# Altium schematic sheet 5V Converter.SchDoc
size A4; SheetNumber: 4; SheetTotal: 4
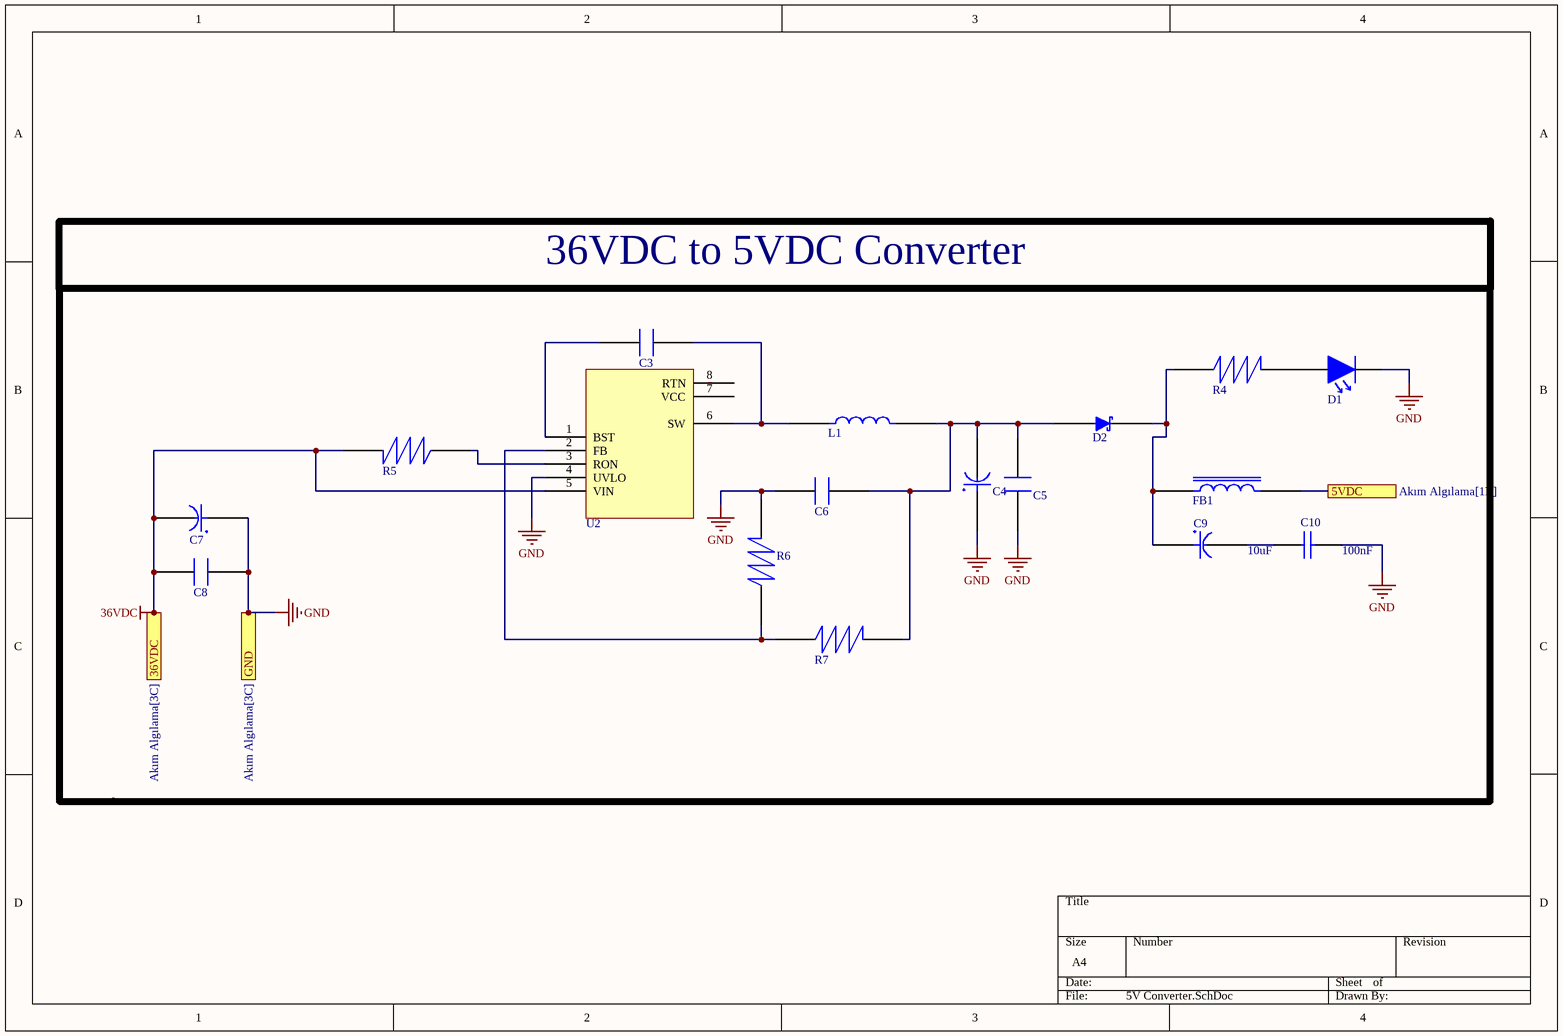
[diagram p0: 5V Converter.SchDoc]

## Parts
C3  C0603C103F3GECAUTO  [CAP_0603]  (value not drawn)
C4  EEV226M025S9DAA  [EEV Series]  (value not drawn)
C5  CL05B104KA5NNNC  [CAP_1005]  (value not drawn)
C6  CL05B104KA5NNNC  [CAP_1005]  (value not drawn)
C7  EEE-FK1H100UR  [CAP_RADIAL_EEE-FK1H100UR]  (value not drawn)
C8  KGM21NR71H104KT  [CAP_2012]  (value not drawn)
C9  value 10uF  [CAP_TANTAL_1411 [3528 Metric]]  (hidden comment: T494B106K016AT)
C10  Capacitance: 100nF  [CAP_0603]  (hidden comment: C0603C104K5RACTU)
D1  LTST-C171GKT  [LED_GREEN_0805]  (value not drawn)
D2  SS14  [SMA-2 (SS14)]  (value not drawn)
FB1  BLM21PG221SN1D  [CAP_0805]  (value not drawn)
L1  SRN8040-101M  [SRN8040-101M]  (value not drawn)
R4  CRG0603F330R  [RES_0603]  (value not drawn)
R5  ERJ-3EKF3303V  [RES_0603]  (value not drawn)
R6  RC0603FR-071K2L  [RES_0603]  (value not drawn)
R7  RC0603FR-106K8L  [RES_0603]  (value not drawn)
U2  LM5017MR/NOPB  [SOIC8]  (value not drawn)

## Blocks framed on the sheet
36VDC to 5VDC Converter: C3-C10 D1 D2 FB1 L1 R4-R7 U2

## Ports
5VDC (see Akım Algılama[1B]), 36VDC (see Akım Algılama[3C]), GND (see Akım Algılama[3C])

## Nets
36VDC: C7.2 C8.1 R5.2 U2.5(VIN) ; port 36VDC
GND: C4.1 C5.2 C6.2 C7.1 C8.2 C10.2 D1.1 R6.2 U2.4(UVLO) ; port GND
5VDC: FB1.2 ; port 5VDC
NetC3_1: C3.1 L1.1 U2.6(SW)
NetC3_2: C3.2 U2.1(BST)
NetC4_2: C4.2 C5.1 C6.1 D2.2 L1.2 R7.2
NetC9_1: C9.1 D2.1 FB1.1 R4.1
NetC9_2: C9.2 C10.1
NetD1_2: D1.2 R4.2
NetR5_1: R5.1 U2.3(RON)
NetR6_1: R6.1 R7.1 U2.2(FB)

Not connected (* = marked no-connect by the designer): U2 7(VCC) 8(RTN)

## Library data of the parts
C3 = C0603C103F3GECAUTO: CAP CER 10000PF 25V C0G/NP0 0603; Manufacturer: KEMET; Designed by: ismet Akalın; Dielectric Material: Ceramic; Supplier: Mouser; Supplier Part Number: 80-C0603C103F3GEAUTO; Manufacturer Part Number: C0603C103F3GECAUTO; RoHS: Yes; Category: Ceramic Capacitors; Stock: 27687; Pricing: 1=0,8, 10=0,507, 50=0,455, 100=0,354, 1000=0,315, 10000=0,314 (USD); Pins: 2; Terminal Finish: Nickel; JESD-609 Code: e3; Capacitor Type: Ceramic; Reach SVHC Compliant: Yes; RoHS Compliant: Yes; ComponentLink1URL: https://datasheet.ciiva.com:443/pdfs/VipMasterIC/IC/KEME/KEME-S-A0008958440/KEME-S-A0008958440-1.pdf?src-supplier=IHS+Markit; ComponentLink1Description: https://datasheet.ciiva.com:443/pdfs/VipMasterIC/IC/KEME/KEME-S-A0008958440/KEME-S-A0008958440-1.pdf?src-supplier=IHS+Markit; ComponentLink2URL: https://datasheet.octopart.com/C0603C103F3GECAUTO-KEMET-datasheet-149521794.pdf?src-supplier=Farnell; ComponentLink2Description: https://datasheet.octopart.com/C0603C103F3GECAUTO-KEMET-datasheet-149521794.pdf?src-supplier=Farnell
C4 = EEV226M025S9DAA: CAP ALUM 22UF 20% 25V SMD; Manufacturer: KEMET; Designed by: ismet Akalın; Capacitor Type: Aluminium; Supplier: Mouser; Supplier Part Number: 80-EEV226M025S9DAA; Manufacturer Part Number: EEV226M025S9DAA; RoHS: Yes; Category: Aluminum Electrolytic Capacitors; Stock: 25705; Pricing: 1=0,32, 10=0,146, 50=0,146, 100=0,103, 1000=0,094, 10000=0,074 (USD); Pins: 2; Reach SVHC Compliant: Yes; RoHS Compliant: Yes; ComponentLink1URL: https://datasheet.ciiva.com:443/pdfs/VipMasterIC/IC/KEME/KEME-S-A0008611149/KEME-S-A0008611149-1.pdf?src-supplier=IHS+Markit; ComponentLink1Description: https://datasheet.ciiva.com:443/pdfs/VipMasterIC/IC/KEME/KEME-S-A0008611149/KEME-S-A0008611149-1.pdf?src-supplier=IHS+Markit; ComponentLink2URL: https://api.kemet.com/component-edge/download/datasheet/EEV226M025S9DAA.pdf?src-supplier=Digikey; ComponentLink2Description: https://api.kemet.com/component-edge/download/datasheet/EEV226M025S9DAA.pdf?src-supplier=Digikey
C5 C6 = CL05B104KA5NNNC: CAP CER 0.1UF 25V X7R 0402; Manufacturer: Samsung; Designed by: ismet Akalın; Dielectric Material: Ceramic; Multilayer: Yes; Tolerance  (fill in as +-): 10%; Supplier: Mouser; Supplier Part Number: 187-CL05B104KA5NNNC; Manufacturer Part Number: CL05B104KA5NNNC; RoHS: Yes; Category: Ceramic Capacitors; Stock: 308112; Pricing: 1=0,1, 10=0,008, 50=0,008, 100=0,007, 1000=0,004, 10000=0,002 (USD); Mounting Technology: Surface Mount; Pins: 2; Package Shape: Rectangular; Case/Package: 0402; Terminal Finish: Nickel; Min Operating Temperature: -55°C; Max Operating Temperature: 125°C; JESD-609 Code: e3; Value: 0.1uF; Capacitor Type: Ceramic; Packaging: Tape and Reel; Tolerance (fill in as +-): 10%; Rated DC Voltage (URdc): 25V; Temperature Characteristics Code: X7R; Termination: Wraparound; Reach SVHC Compliant: Yes; RoHS Compliant: Yes; ComponentLink1URL: https://datasheet.ciiva.com:443/pdfs/VipMasterIC/IC/SEMS/SEMS-S-A0008525088/SEMS-S-A0008525148-1.pdf?src-supplier=IHS+Markit; ComponentLink1Description: https://datasheet.ciiva.com:443/pdfs/VipMasterIC/IC/SEMS/SEMS-S-A0008525088/SEMS-S-A0008525148-1.pdf?src-supplier=IHS+Markit; ComponentLink2URL: http://www.samsungsem.com/kr/support/product-search/mlcc/CL05B104KA5NNNC.jsp?src-supplier=Digikey; ComponentLink2Description: http://www.samsungsem.com/kr/support/product-search/mlcc/CL05B104KA5NNNC.jsp?src-supplier=Digikey; ComponentLink3URL: https://datasheet.octopart.com/CL05B104KA5NNNC-Samsung-Electro-Mechanics-datasheet-116890910.pdf?src-supplier=Future+Electronics; ComponentLink3Description: https://datasheet.octopart.com/CL05B104KA5NNNC-Samsung-Electro-Mechanics-datasheet-116890910.pdf?src-supplier=Future+Electronics
C7 = EEE-FK1H100UR: CAP ALUM 10UF 20% 50V SMD; Manufacturer: Panasonic; Designed by: ismet Akalın; Dielectric Material: Aluminium; Polarity: Polarized; Leakage Current: 5uA; Ripple Current: 63.75mA; Tan Delta: 0.1; Reference Standard: AEC-Q200; Supplier: Mouser; Supplier Part Number: 667-EEE-FK1H100UR; Manufacturer Part Number: EEE-FK1H100UR; RoHS: Yes; Category: Aluminum Electrolytic Capacitors; Stock: 33696; Pricing: 1=0,36, 10=0,197, 50=0,197, 100=0,166, 1000=0,105, 10000=0,092 (USD); Mounting Technology: Surface Mount; Pins: 2; Case/Package: 2121; Min Operating Temperature: -55°C; Max Operating Temperature: 105°C; Value: 10uF; Capacitor Type: Aluminium; Tolerance  (fill in as +-): 20%; Package Style: SMTMeter; Packaging: Tape and Reel; Tolerance (fill in as +-): 20%; Rated DC Voltage (URdc): 50V; Termination: Flat; Length: 6.5mm; Width: 5.3mm; Height: 5.8mm; Reach SVHC Compliant: Yes; RoHS Compliant: Yes; ComponentLink1URL: https://datasheet.ciiva.com:443/pdfs/VipMasterIC/IC/PANA/PANA-S-A0009782343/PANA-S-A0009782343-1.pdf?src-supplier=IHS+Markit; ComponentLink1Description: https://datasheet.ciiva.com:443/pdfs/VipMasterIC/IC/PANA/PANA-S-A0009782343/PANA-S-A0009782343-1.pdf?src-supplier=IHS+Markit; ComponentLink2URL: https://datasheet.ciiva.com/11777/0900766b80e4e8b0-11777247.pdf?src-supplier=Rs; ComponentLink2Description: https://datasheet.ciiva.com/11777/0900766b80e4e8b0-11777247.pdf?src-supplier=Rs; ComponentLink3URL: https://datasheet.ciiva.com/29313/443489-da-01-en-smd-elko-vfk-c-10-uf-50v-29313597.pdf?src-supplier=Conrad; ComponentLink3Description: https://datasheet.ciiva.com/29313/443489-da-01-en-smd-elko-vfk-c-10-uf-50v-29313597.pdf?src-supplier=Conrad; ComponentLink4URL: https://datasheet.ciiva.com/48524/fk-eng-tds-48524072.pdf?src-supplier=Distrelec; ComponentLink4Description: https://datasheet.ciiva.com/48524/fk-eng-tds-48524072.pdf?src-supplier=Distrelec; ComponentLink5URL: https://datasheet.ciiva.com/43463/58258-43463526.pdf?src-supplier=Farnell; ComponentLink5Description: https://datasheet.ciiva.com/43463/58258-43463526.pdf?src-supplier=Farnell; ComponentLink6URL: https://datasheet.ciiva.com/46385/58258-46385983.pdf?src-supplier=Element14; ComponentLink6Description: https://datasheet.ciiva.com/46385/58258-46385983.pdf?src-supplier=Element14; ComponentLink7URL: https://datasheet.ciiva.com/14594/70258115-14594166.pdf?src-supplier=Allied+Electronics; ComponentLink7Description: https://datasheet.ciiva.com/14594/70258115-14594166.pdf?src-supplier=Allied+Electronics; ComponentLink8URL: https://datasheet.ciiva.com/46385/1676921-46385982.pdf?src-supplier=Element14; ComponentLink8Description: https://datasheet.ciiva.com/46385/1676921-46385982.pdf?src-supplier=Element14
C8 = KGM21NR71H104KT: CAP CER 0.1UF 50V X7R 0805; Manufacturer: Kyocera AVX; Manufacturer Part Number: 08055C104KAT2A; Designed by: ismet Akalın; Dielectric Material: Ceramic; Multilayer: Yes; Tolerance  (fill in as +-): 10%; Supplier: Mouser; Supplier Part Number: 581-08055C104K; RoHS: Yes; Category: Ceramic Capacitors; Stock: 1054406; Pricing: 1=0,1, 10=0,053, 50=0,053, 100=0,032, 1000=0,029, 10000=0,024 (USD); Mounting Technology: Surface Mount; Pins: 2; Package Shape: Rectangular; Case/Package: 0805; Terminal Finish: Nickel; Min Operating Temperature: -55°C; Max Operating Temperature: 125°C; JESD-609 Code: e3; Value: 0.1UF; Capacitor Type: Ceramic; Package Style: SMTMeter; Packaging: Tape and Reel; Tolerance (fill in as +-): 10%; Rated DC Voltage (URdc): 50V; Temperature Characteristics Code: X7R; Termination: Wraparound; Length: 2.01mm; Width: 1.25mm; Height: 0.94mm; Reach SVHC Compliant: Yes; RoHS Compliant: Yes; ComponentLink1URL: https://datasheet.ciiva.com:443/pdfs/VipMasterIC/IC/AVXC/AVXC-S-A0009640452/AVXC-S-A0009640452-1.pdf?src-supplier=IHS+Markit; ComponentLink1Description: https://datasheet.ciiva.com:443/pdfs/VipMasterIC/IC/AVXC/AVXC-S-A0009640452/AVXC-S-A0009640452-1.pdf?src-supplier=IHS+Markit; ComponentLink2URL: https://datasheet.ciiva.com/11786/0900766b802d4698-11786116.pdf?src-supplier=Rs; ComponentLink2Description: https://datasheet.ciiva.com/11786/0900766b802d4698-11786116.pdf?src-supplier=Rs; ComponentLink3URL: https://datasheet.ciiva.com/16199/cx7r-16199014.pdf?src-supplier=Future+Electronics; ComponentLink3Description: https://datasheet.ciiva.com/16199/cx7r-16199014.pdf?src-supplier=Future+Electronics; ComponentLink4URL: https://datasheet.ciiva.com/150/cx7r-150259.pdf?src-supplier=Digikey; ComponentLink4Description: https://datasheet.ciiva.com/150/cx7r-150259.pdf?src-supplier=Digikey; ComponentLink5URL: https://datasheet.ciiva.com/7812/cx7r-7812079.pdf?src-supplier=Element14; ComponentLink5Description: https://datasheet.ciiva.com/7812/cx7r-7812079.pdf?src-supplier=Element14; ComponentLink6URL: https://datasheet.ciiva.com/2988/cx7r-2988014.pdf?src-supplier=Avnet; ComponentLink6Description: https://datasheet.ciiva.com/2988/cx7r-2988014.pdf?src-supplier=Avnet
C9 = T494B106K016AT: TANTAL CAP 10UF 10% 16V SMD 1411 [3528 Metric] Polarized; Manufacturer: KEMET; Dielectric Material: Tantalum; ESR (Equivalent Series Resistance): 800mR; Leakage Current: 1.6uA; Ripple Current: 130.4mA; Tan Delta: 0.06; Reference Standard: AEC-Q200; Designed by: ismet Akalın; Supplier: Farnell; Supplier Part Number: 1692399; Manufacturer Part Number: T494B106K016AT; RoHS: Yes; Category: Tantalum Capacitors; Stock: 3665; Pricing: 10=0,421, 50=0,384, 100=0,347, 500=0,346, 1000=0,345 (EUR); Mounting Technology: Surface Mount; Pins: 2; Package Shape: Rectangular; Case/Package: 1411; Terminal Finish: Nickel; Min Operating Temperature: -55°C; Max Operating Temperature: 125°C; JESD-609 Code: e3; Polarity: Polarized; Capacitor Type: Tantalum; Tolerance  (fill in as +-): 10%; Package Style: SMTMeter; Packaging: Tape and Reel; Tolerance (fill in as +-): 10%; Rated DC Voltage (URdc): 16V; Termination: J BEND; Length: 3.5mm; Width: 2.8mm; Height: 1.9mm; Reach SVHC Compliant: Yes; RoHS Compliant: Yes; ComponentLink1URL: https://datasheet.ciiva.com:443/pdfs/VipMasterIC/IC/KEME/KEME-S-A0009782346/KEME-S-A0009782346-1.pdf?src-supplier=IHS+Markit; ComponentLink1Description: https://datasheet.ciiva.com:443/pdfs/VipMasterIC/IC/KEME/KEME-S-A0009782346/KEME-S-A0009782346-1.pdf?src-supplier=IHS+Markit; ComponentLink2URL: https://datasheet.ciiva.com/27747/1574858-27747690.pdf?src-supplier=Jameco; ComponentLink2Description: https://datasheet.ciiva.com/27747/1574858-27747690.pdf?src-supplier=Jameco; ComponentLink3URL: https://datasheet.ciiva.com/7696/1684480-7696458.pdf?src-supplier=Element14; ComponentLink3Description: https://datasheet.ciiva.com/7696/1684480-7696458.pdf?src-supplier=Element14; ComponentLink4URL: https://datasheet.ciiva.com/258/kem-t2008-t494-258909.pdf?src-supplier=Digikey; ComponentLink4Description: https://datasheet.ciiva.com/258/kem-t2008-t494-258909.pdf?src-supplier=Digikey; ComponentLink5URL: https://datasheet.ciiva.com/258/kem-t2008-t494-258910.pdf?src-supplier=Digikey; ComponentLink5Description: https://datasheet.ciiva.com/258/kem-t2008-t494-258910.pdf?src-supplier=Digikey; ComponentLink6URL: https://datasheet.ciiva.com/258/kem-t2008-t494-258911.pdf?src-supplier=Digikey; ComponentLink6Description: https://datasheet.ciiva.com/258/kem-t2008-t494-258911.pdf?src-supplier=Digikey; ComponentLink7URL: https://datasheet.ciiva.com/14588/70095890-14588342.pdf?src-supplier=Allied+Electronics; ComponentLink7Description: https://datasheet.ciiva.com/14588/70095890-14588342.pdf?src-supplier=Allied+Electronics
C10 = CAP CER 100nF 0603: CAP CER 100nF %10 0603 SMD; Manufacturer: KEMET; Designed by: BERK; Dielectric Material: Ceramic; Voltage Rating (DC): 50V; Tolerance: 10%; Dielectric: X7R; Dissipation Factor: 2.5%; Supplier 1: Digi-Key; Manufacturer Part Number: C0603C104K5RACTU; RoHS: Yes; Category: Ceramic Capacitors; Stock 1: 1666186; Pricing 1: 1=0,12000, 10=0,08500, 50=0,04620, 100=0,03770, 500=0,02696, 1000=0,02118 (USD); Mount: Surface Mount; Case/Package: 0603; Number of Pins: 2; Case Code (Metric): 1608; Case Code (Imperial): 0603; Contact Plating: Tin,Matte; Min Operating Temperature: -55°C; Max Operating Temperature: 125°C; Packaging: Tape and Reel; Package Quantity: 1; Termination: SMD/SMT; Voltage: 50V; Voltage Rating: 50V; Series: SMD Comm X7R; Length: 0.063inch; Width: 0.031inch; Height: 0.8mm; Thickness: 0.034inch; Lead Pitch: 0.7mm; Depth: 0.8mm; Radiation Hardening: No; RoHS Compliant: Yes; REACH SVHC: No SVHC; ComponentLink1URL: https://datasheet.ciiva.com/7823/kem-c1002-x7r-smd-7823591.pdf?src-supplier=Element14; ComponentLink1Description: https://datasheet.ciiva.com/7823/kem-c1002-x7r-smd-7823591.pdf?src-supplier=Element14; ComponentLink2URL: https://datasheet.ciiva.com/14602/70095383-14602583.pdf?src-supplier=Allied+Electronics; ComponentLink2Description: https://datasheet.ciiva.com/14602/70095383-14602583.pdf?src-supplier=Allied+Electronics; ComponentLink3URL: https://datasheet.ciiva.com/5999/kem-c1002-x7r-smd-5999400.pdf?src-supplier=Farnell; ComponentLink3Description: https://datasheet.ciiva.com/5999/kem-c1002-x7r-smd-5999400.pdf?src-supplier=Farnell; ComponentLink4URL: https://datasheet.ciiva.com/7823/kem-c1002-x7r-smd-7823592.pdf?src-supplier=Element14; ComponentLink4Description: https://datasheet.ciiva.com/7823/kem-c1002-x7r-smd-7823592.pdf?src-supplier=Element14; ComponentLink5URL: https://datasheet.ciiva.com/28645/1851736-28645640.pdf?src-supplier=Element14; ComponentLink5Description: https://datasheet.ciiva.com/28645/1851736-28645640.pdf?src-supplier=Element14; ComponentLink6URL: https://datasheet.ciiva.com/14585/70095383-14585209.pdf?src-supplier=Allied+Electronics; ComponentLink6Description: https://datasheet.ciiva.com/14585/70095383-14585209.pdf?src-supplier=Allied+Electronics; Supplier Part Number 1: 399-5089-1-ND
D1 = LED GREEN 0805: Green 0805 130 º Min 5 mcd Typical 12 mcd Water Clear Lens SMT LED; Manufacturer: Vishay Lite-On; Designed by: BERK; Lens Color: Colorless; Viewing Angle: 130°; Lens Style: Diffused,Colorless,Rectangular,Clear; Luminous Intensity: 12mcd; Forward Current: 30mA; Forward Voltage: 2.1V; Power Rating: 100mW; Dominant Wavelength: 569nm; Test Current: 10mA; Number of Elements: 1; Wavelength: 585nm; Reverse Voltage: 5V; Supplier 1: Digi-Key; Manufacturer Part Number: LTST-C171GKT; RoHS: Yes; Category: LEDs; Stock 1: 159023; Pricing 1: 1=0,26000, 10=0,14100, 100=0,06560, 500=0,06060, 1000=0,04747 (USD); Mount: Surface Mount; Case/Package: 0805; Number of Pins: 2; Color: Green; Case Code (Metric): 2012; Case Code (Imperial): 0805; Min Operating Temperature: -55°C; Max Operating Temperature: 85°C; Package Quantity: 1; Packaging: Tape and Reel; Illumination Color: Green; Lens Transparency: Clear; Power Dissipation: 100mW; Number of LEDs: 1; Series: CHIPLED 0805; Length: 2mm; Width: 1.25mm; Height: 0.8mm; Depth: 1.25mm; Radiation Hardening: No; Lead Free: Lead Free; RoHS Compliant: Yes; ComponentLink1URL: https://datasheet.ciiva.com/2110/ltst-c171gkt-2110000.pdf?src-supplier=Digi-Key; ComponentLink1Description: https://datasheet.ciiva.com/2110/ltst-c171gkt-2110000.pdf?src-supplier=Digi-Key; ComponentLink2URL: https://datasheet.ciiva.com/11773/0900766b80dc0296-11773991.pdf?src-supplier=RSComponents; ComponentLink2Description: https://datasheet.ciiva.com/11773/0900766b80dc0296-11773991.pdf?src-supplier=RSComponents; ComponentLink3URL: https://datasheet.ciiva.com/12400/lite-on-ltst-c171gkt-190133-12400647.pdf?src-supplier=Mouser; ComponentLink3Description: https://datasheet.ciiva.com/12400/lite-on-ltst-c171gkt-190133-12400647.pdf?src-supplier=Mouser; ComponentLink4URL: https://datasheet.ciiva.com/2110/ltst-c171gkt-2110001.pdf?src-supplier=Digi-Key; ComponentLink4Description: https://datasheet.ciiva.com/2110/ltst-c171gkt-2110001.pdf?src-supplier=Digi-Key; ComponentLink5URL: https://datasheet.ciiva.com/2110/ltst-c171gkt-2110002.pdf?src-supplier=Digi-Key; ComponentLink5Description: https://datasheet.ciiva.com/2110/ltst-c171gkt-2110002.pdf?src-supplier=Digi-Key; ComponentLink6URL: https://datasheet.ciiva.com/16396/ltst-c171gkt-16396549.pdf?src-supplier=Future+Electronics; ComponentLink6Description: https://datasheet.ciiva.com/16396/ltst-c171gkt-16396549.pdf?src-supplier=Future+Electronics; Supplier Part Number 1: 160-1423-1-ND
D2 = SS14: DIODE SCHOTTKY 40V 1A DO214AC; Manufacturer: ON Semiconductor / Fairchild; Designed by: ismet Akalın; Package Body Material: Plastic; Diode Element Material: SILICON; Diode Type: RECTIFIER; Number of Elements: 1; Forward Voltage: 500mV; Max Power Dissipation: 1.1W; Additional Feature: FREE WHEELING DIODE; Non-rep Pk Forward Current-Max: 30A; Qualification Status: Not Qualified; JEDEC-95 Code: DO-214AC; Supplier: Mouser; Supplier Part Number: 512-SS14; Manufacturer Part Number: SS14; RoHS: Yes; Category: Schottky Diodes; Stock: 78089; Pricing: 1=0,29, 10=0,195, 50=0,195, 100=0,117, 1000=0,088, 10000=0,063 (USD); Pins: 2; Package Shape: Rectangular; Terminal Finish: Tin; Min Operating Temperature: -65°C; Max Operating Temperature: 125°C; JESD-30 Code: R-PDSO-C2; Surface Mount: Yes; Technology: SCHOTTKY; Terminal Form: C BEND; Terminal Position: DUAL; Max Output current: 1A; Package Style: SMALL OUTLINEMeter; Rep Pk Reverse Voltage-Max: 40V; Moisture Sensitivity Level: 1; JESD-609 Code: e3; RoHS Compliant: Yes; Reach SVHC Compliant: No; ComponentLink1URL: https://datasheet.ciiva.com:443/pdfs/VipMasterIC/IC/ONSM/ONSM-S-A0007316185/ONSM-S-A0007316185-1.pdf?src-supplier=IHS+Markit; ComponentLink1Description: https://datasheet.ciiva.com:443/pdfs/VipMasterIC/IC/ONSM/ONSM-S-A0007316185/ONSM-S-A0007316185-1.pdf?src-supplier=IHS+Markit; ComponentLink2URL: http://www.onlinecomponents.com/datasheet/ss14.aspx?p=11369800&src-supplier=Onlinecomponents.com; ComponentLink2Description: http://www.onlinecomponents.com/datasheet/ss14.aspx?p=11369800&src-supplier=Onlinecomponents.com; ComponentLink3URL: http://www.produktinfo.conrad.com/datenblaetter/1200000-1299999/001265127-da-01-en-DIODE_SCHOTTKY_40V_1A_SS14_DO_214_AC_FSC.pdf?src-supplier=Conrad; ComponentLink3Description: http://www.produktinfo.conrad.com/datenblaetter/1200000-1299999/001265127-da-01-en-DIODE_SCHOTTKY_40V_1A_SS14_DO_214_AC_FSC.pdf?src-supplier=Conrad; ComponentLink4URL: https://www.verical.com/server-webapp/html/getDatasheet?partID=84776&src-supplier=Verical; ComponentLink4Description: https://www.verical.com/server-webapp/html/getDatasheet?partID=84776&src-supplier=Verical; ComponentLink5URL: https://datasheet.octopart.com/SS14.-Fairchild-Semiconductor-datasheet-3545.pdf?src-supplier=Element14; ComponentLink5Description: https://datasheet.octopart.com/SS14.-Fairchild-Semiconductor-datasheet-3545.pdf?src-supplier=Element14
FB1 = BLM21PG221SN1D: FERRITE BEAD 220 OHM 0805 1LN; Manufacturer: Murata; Channels: 1; DC Resistance-Max: 50mR; Filter Type: FERRITE CHIP; Clock Frequency: 100MHz; Output Impedance: 220R; Current Rating: 2A; Designed by: ismet Akalın; Supplier: Farnell; Supplier Part Number: 1515661; Manufacturer Part Number: BLM21PG221SN1D; RoHS: Yes; Category: Ferrite Beads and Chips; Stock: 72841; Pricing: 10=0,0682, 100=0,0519, 500=0,0417, 1000=0,0367, 2000=0,0313, 4000=0,0258 (EUR); Mounting Technology: Surface Mount; Terminal Finish: Nickel; Material: Ferrite; Case Code: 0805; Min Operating Temperature: -55°C; Max Operating Temperature: 125°C; JESD-609 Code: e3; Construction: Chip Bead; Min Frequency: 100MHz; Packaging: Tape and Reel; Length: 2mm; Width: 1.25mm; Height: 0.85mm; Reach SVHC Compliant: Yes; RoHS Compliant: Yes; ComponentLink1URL: https://datasheet.ciiva.com:443/pdfs/VipMasterIC/IC/MURE/MURE-S-A0008513560/MURE-S-A0008513560-1.pdf?src-supplier=IHS+Markit; ComponentLink1Description: https://datasheet.ciiva.com:443/pdfs/VipMasterIC/IC/MURE/MURE-S-A0008513560/MURE-S-A0008513560-1.pdf?src-supplier=IHS+Markit; ComponentLink2URL: https://datasheet.ciiva.com/30514/1845321-30514028.pdf?src-supplier=Jameco; ComponentLink2Description: https://datasheet.ciiva.com/30514/1845321-30514028.pdf?src-supplier=Jameco; ComponentLink3URL: https://datasheet.ciiva.com/1012/l0110s0100blm21p-1012288.pdf?src-supplier=Digikey; ComponentLink3Description: https://datasheet.ciiva.com/1012/l0110s0100blm21p-1012288.pdf?src-supplier=Digikey; ComponentLink4URL: https://datasheet.ciiva.com/11799/0900766b81275e31-11799232.pdf?src-supplier=Rs; ComponentLink4Description: https://datasheet.ciiva.com/11799/0900766b81275e31-11799232.pdf?src-supplier=Rs; ComponentLink5URL: https://datasheet.ciiva.com/29348/442529-da-01-en-chip-drossel-0805-220r-2000ma-2-0x1-25mm-29348007.pdf?src-supplier=Conrad; ComponentLink5Description: https://datasheet.ciiva.com/29348/442529-da-01-en-chip-drossel-0805-220r-2000ma-2-0x1-25mm-29348007.pdf?src-supplier=Conrad; ComponentLink6URL: https://datasheet.ciiva.com/1012/l0110s0100blm21p-1012287.pdf?src-supplier=Digikey; ComponentLink6Description: https://datasheet.ciiva.com/1012/l0110s0100blm21p-1012287.pdf?src-supplier=Digikey; ComponentLink7URL: https://datasheet.ciiva.com/1012/l0110s0100blm21p-1012289.pdf?src-supplier=Digikey; ComponentLink7Description: https://datasheet.ciiva.com/1012/l0110s0100blm21p-1012289.pdf?src-supplier=Digikey; ComponentLink8URL: https://datasheet.ciiva.com/3081/l0110s0100blm21p-3081655.pdf?src-supplier=Avnet; ComponentLink8Description: https://datasheet.ciiva.com/3081/l0110s0100blm21p-3081655.pdf?src-supplier=Avnet; ComponentLink9URL: https://datasheet.ciiva.com/16215/l0110s0100blm21p-16215194.pdf?src-supplier=Future+Electronics; ComponentLink9Description: https://datasheet.ciiva.com/16215/l0110s0100blm21p-16215194.pdf?src-supplier=Future+Electronics; ComponentLink10URL: https://datasheet.ciiva.com/8021/1756152-8021596.pdf?src-supplier=Element14; ComponentLink10Description: https://datasheet.ciiva.com/8021/1756152-8021596.pdf?src-supplier=Element14; ComponentLink11URL: https://datasheet.ciiva.com/8021/1756152-8021598.pdf?src-supplier=Element14; ComponentLink11Description: https://datasheet.ciiva.com/8021/1756152-8021598.pdf?src-supplier=Element14; ComponentLink12URL: https://datasheet.ciiva.com/14122/anblm21p-data-e-14122214.pdf?src-supplier=Distrelec; ComponentLink12Description: https://datasheet.ciiva.com/14122/anblm21p-data-e-14122214.pdf?src-supplier=Distrelec
L1 = SRN8040-101M: FIXED IND 100UH 1A 400 MOHM SMD; Manufacturer: Bourns; Core Material: Ferrite; Tolerance: 20%; Case/Size Code: 3232; DC Resistance (DCR): 400mR; Inductor Application: POWER INDUCTOR; Inductor Type: GENERAL PURPOSE INDUCTOR; Channels: 1; Shape/Size Description: RECTANGULAR PACKAGE; Shielding: Shielded; Test Frequency: 100kHz; Package Height: 4mm; Package Length: 8mm; Designed by: ismet Akalın; Supplier: Mouser; Supplier Part Number: 652-SRN8040-101M; Manufacturer Part Number: SRN8040-101M; RoHS: Yes; Category: Fixed Inductors; Stock: 21385; Pricing: 1=0,7, 10=0,513, 50=0,513, 100=0,439, 1000=0,272, 10000=0,253 (USD); Pins: 2; Terminal Finish: Copper; Min Operating Temperature: -40°C; Max Operating Temperature: 105°C; JESD-609 Code: e1; Construction: Shielded; Inductance-Nom (L): 100uH; Package Style: SMTMeter; Packaging: Tape and Reel; Max Current Rating: 1A; Surface Mount: Yes; Terminal Placement: Dual Ended; Termination: One Surface; Package Width: 8mm; Reach SVHC Compliant: Yes; RoHS Compliant: Yes; ComponentLink1URL: https://datasheet.ciiva.com:443/pdfs/VipMasterIC/IC/BOUR/BOUR-S-A0007011240/BOUR-S-A0007011240-1.pdf?src-supplier=IHS+Markit; ComponentLink1Description: https://datasheet.ciiva.com:443/pdfs/VipMasterIC/IC/BOUR/BOUR-S-A0007011240/BOUR-S-A0007011240-1.pdf?src-supplier=IHS+Markit; ComponentLink2URL: https://datasheet.ciiva.com/6689/srn8040-6689481.pdf?src-supplier=Digikey; ComponentLink2Description: https://datasheet.ciiva.com/6689/srn8040-6689481.pdf?src-supplier=Digikey; ComponentLink3URL: https://datasheet.ciiva.com/1049/srn8040-1049477.pdf?src-supplier=Digikey; ComponentLink3Description: https://datasheet.ciiva.com/1049/srn8040-1049477.pdf?src-supplier=Digikey; ComponentLink4URL: https://datasheet.ciiva.com/1049/srn8040-1049478.pdf?src-supplier=Digikey; ComponentLink4Description: https://datasheet.ciiva.com/1049/srn8040-1049478.pdf?src-supplier=Digikey; ComponentLink5URL: https://datasheet.ciiva.com/8515/srn8040-8515246.pdf?src-supplier=Avnet; ComponentLink5Description: https://datasheet.ciiva.com/8515/srn8040-8515246.pdf?src-supplier=Avnet
R4 = CRG0603F330R: RES SMD 330 OHM 1% 1/10W 0603; Manufacturer: TE Connectivity; Manufacturer Series: CRG; Designed by: ismet Akalın; Additional Feature: LASER TRIMMABLE; Power: 100mW; Rated Temperature: 70°C; Value: 330R; Working Voltage: 50V; Temperature Coefficient (ppm/Cel): 100; Supplier: Mouser; Supplier Part Number: 279-CRG0603F330R; Manufacturer Part Number: CRG0603F330R; RoHS: Yes; Category: Chip SMD Resistors; Stock: 26411; Pricing: 1=0,1, 10=0,023, 50=0,023, 100=0,012, 1000=0,006, 10000=0,004 (USD); Mounting Technology: Surface Mount; Pins: 2; Package Shape: Rectangular; Case/Package: 0603; Terminal Finish: Tin; Min Operating Temperature: -55°C; Max Operating Temperature: 125°C; Tolerance: 1%; JESD-609 Code: e3; Resistor Type: FIXED RESISTOR; Packaging: Tape and Reel; Technology: METAL GLAZE/THICK FILM; Termination: Wraparound; RoHS Compliant: Yes; ComponentLink1URL: https://datasheet.ciiva.com:443/pdfs/VipMasterIC/IC/TYEC/TYECS00469/TYECS00469-1.pdf?src-supplier=IHS+Markit; ComponentLink1Description: https://datasheet.ciiva.com:443/pdfs/VipMasterIC/IC/TYEC/TYECS00469/TYECS00469-1.pdf?src-supplier=IHS+Markit; ComponentLink2URL: https://datasheet.ciiva.com/11812/0900766b800a696e-11812377.pdf?src-supplier=Rs; ComponentLink2Description: https://datasheet.ciiva.com/11812/0900766b800a696e-11812377.pdf?src-supplier=Rs; ComponentLink3URL: https://datasheet.ciiva.com/2529/eng-cd-1622918-ba-2529817.pdf?src-supplier=Digikey; ComponentLink3Description: https://datasheet.ciiva.com/2529/eng-cd-1622918-ba-2529817.pdf?src-supplier=Digikey; ComponentLink4URL: https://datasheet.ciiva.com/8904/eng-ds-1773204-f-8904639.pdf?src-supplier=Avnet; ComponentLink4Description: https://datasheet.ciiva.com/8904/eng-ds-1773204-f-8904639.pdf?src-supplier=Avnet
R5 = ERJ-3EKF3303V: RES SMD 330K OHM 1% 1/10W 0603; Manufacturer: Panasonic; Designed by: ismet Akalın; Power: 100mW; Rated Temperature: 70°C; Value: 330kR; Working Voltage: 75V; Temperature Coefficient (ppm/Cel): 100; Package Height: 0.45mm; Package Length: 1.6mm; Package Width: 0.8mm; Reference Standard: AEC-Q200; Supplier: Mouser; Supplier Part Number: 667-ERJ-3EKF3303V; Manufacturer Part Number: ERJ-3EKF3303V; RoHS: Yes; Category: Chip SMD Resistors; Stock: 27005; Pricing: 1=0,1, 10=0,028, 50=0,028, 100=0,016, 1000=0,009, 10000=0,005 (USD); Mounting Technology: Surface Mount; Pins: 2; Package Shape: Rectangular; Case/Package: 0603; Terminal Finish: Nickel; Min Operating Temperature: -55°C; Max Operating Temperature: 155°C; Tolerance: 1%; JESD-609 Code: e3; Resistor Type: FIXED RESISTOR; Construction: Rectangular; Packaging: Tape and Reel; Technology: METAL GLAZE/THICK FILM; Termination: Wraparound; Reach SVHC Compliant: Yes; RoHS Compliant: Yes; ComponentLink1URL: https://datasheet.ciiva.com:443/pdfs/VipMasterIC/IC/PANA/PANA-S-A0009889626/PANA-S-A0009889626-1.pdf?src-supplier=IHS+Markit; ComponentLink1Description: https://datasheet.ciiva.com:443/pdfs/VipMasterIC/IC/PANA/PANA-S-A0009889626/PANA-S-A0009889626-1.pdf?src-supplier=IHS+Markit; ComponentLink2URL: https://datasheet.ciiva.com/7836/aoa0000ce2-7836502.pdf?src-supplier=Element14; ComponentLink2Description: https://datasheet.ciiva.com/7836/aoa0000ce2-7836502.pdf?src-supplier=Element14; ComponentLink3URL: https://datasheet.ciiva.com/22673/1678782-22673287.pdf?src-supplier=Element14; ComponentLink3Description: https://datasheet.ciiva.com/22673/1678782-22673287.pdf?src-supplier=Element14; ComponentLink4URL: https://datasheet.ciiva.com/22687/1678782-22687435.pdf?src-supplier=Element14; ComponentLink4Description: https://datasheet.ciiva.com/22687/1678782-22687435.pdf?src-supplier=Element14; ComponentLink5URL: https://datasheet.ciiva.com/24164/aoa0000ce2-24164038.pdf?src-supplier=Mouser; ComponentLink5Description: https://datasheet.ciiva.com/24164/aoa0000ce2-24164038.pdf?src-supplier=Mouser; ComponentLink6URL: https://datasheet.ciiva.com/16766/70260748-16766613.pdf?src-supplier=Allied+Electronics; ComponentLink6Description: https://datasheet.ciiva.com/16766/70260748-16766613.pdf?src-supplier=Allied+Electronics; ComponentLink7URL: https://datasheet.ciiva.com/16781/70260748-16781705.pdf?src-supplier=Allied+Electronics; ComponentLink7Description: https://datasheet.ciiva.com/16781/70260748-16781705.pdf?src-supplier=Allied+Electronics; ComponentLink8URL: https://datasheet.ciiva.com/9182/aoa0000ce2-9182954.pdf?src-supplier=Avnet; ComponentLink8Description: https://datasheet.ciiva.com/9182/aoa0000ce2-9182954.pdf?src-supplier=Avnet; ComponentLink9URL: https://datasheet.ciiva.com/9117/aoa0000ce2-9117145.pdf?src-supplier=Avnet; ComponentLink9Description: https://datasheet.ciiva.com/9117/aoa0000ce2-9117145.pdf?src-supplier=Avnet; ComponentLink10URL: https://datasheet.ciiva.com/30247/aoa0000ce2-30247322.pdf?src-supplier=Onlinecomponents.com; ComponentLink10Description: https://datasheet.ciiva.com/30247/aoa0000ce2-30247322.pdf?src-supplier=Onlinecomponents.com
R6 = RC0603FR-071K2L: RES 1.2K OHM 1% 1/10W 0603; Manufacturer: Yageo; Designed by: ismet Akalın; Additional Feature: LASER TRIMMABLE; Power: 100mW; Rated Temperature: 70°C; Value: 1.2kR; Working Voltage: 75V; Temperature Coefficient (ppm/Cel): 100; Package Height: 0.45mm; Package Length: 1.6mm; Package Width: 0.8mm; Supplier: Mouser; Supplier Part Number: 603-RC0603FR-071K2L; Manufacturer Part Number: RC0603FR-071K2L; RoHS: Yes; Category: Chip SMD Resistors; Stock: 2788; Pricing: 1=0,1, 10=0,009, 50=0,009, 100=0,008, 1000=0,006, 10000=0,003 (USD); Mounting Technology: Surface Mount; Pins: 2; Package Shape: Rectangular; Case/Package: 0603; Terminal Finish: Nickel; Min Operating Temperature: -55°C; Max Operating Temperature: 155°C; Tolerance: 1%; JESD-609 Code: e3; Resistor Type: FIXED RESISTOR; Construction: Chip; Packaging: Tape and Reel; Technology: METAL GLAZE/THICK FILM; Termination: Wraparound; Reach SVHC Compliant: Yes; RoHS Compliant: Yes; ComponentLink1URL: https://datasheet.ciiva.com:443/pdfs/VipMasterIC/IC/YAGO/YAGO-S-A0008145938/YAGO-S-A0008145938-1.pdf?src-supplier=IHS+Markit; ComponentLink1Description: https://datasheet.ciiva.com:443/pdfs/VipMasterIC/IC/YAGO/YAGO-S-A0008145938/YAGO-S-A0008145938-1.pdf?src-supplier=IHS+Markit; ComponentLink2URL: http://www.farnell.com/datasheets/2167052.pdf?src-supplier=Farnell; ComponentLink2Description: http://www.farnell.com/datasheets/2167052.pdf?src-supplier=Farnell; ComponentLink3URL: http://www.farnell.com/datasheets/1868787.pdf?src-supplier=Farnell; ComponentLink3Description: http://www.farnell.com/datasheets/1868787.pdf?src-supplier=Farnell; ComponentLink4URL: http://www.farnell.com/datasheets/443971.pdf?src-supplier=Farnell; ComponentLink4Description: http://www.farnell.com/datasheets/443971.pdf?src-supplier=Farnell; ComponentLink5URL: http://www.mouser.com/ds/2/447/RC0603-272842.pdf?src-supplier=Mouser; ComponentLink5Description: http://www.mouser.com/ds/2/447/RC0603-272842.pdf?src-supplier=Mouser; ComponentLink6URL: http://www.farnell.com/datasheets/2167052.pdf?src-supplier=Element14; ComponentLink6Description: http://www.farnell.com/datasheets/2167052.pdf?src-supplier=Element14; ComponentLink7URL: https://datasheet.octopart.com/RC0603FR-071K2L-Yageo-datasheet-164759695.pdf?src-supplier=Future+Electronics; ComponentLink7Description: https://datasheet.octopart.com/RC0603FR-071K2L-Yageo-datasheet-164759695.pdf?src-supplier=Future+Electronics; ComponentLink8URL: http://www.farnell.com/datasheets/2167052.pdf?src-supplier=Newark; ComponentLink8Description: http://www.farnell.com/datasheets/2167052.pdf?src-supplier=Newark; ComponentLink9URL: http://www.yageo.com/documents/recent/PYu-RC_Group_51_RoHS_L_9.pdf?src-supplier=Digikey; ComponentLink9Description: http://www.yageo.com/documents/recent/PYu-RC_Group_51_RoHS_L_9.pdf?src-supplier=Digikey; ComponentLink10URL: http://www.farnell.com/datasheets/1868787.pdf?src-supplier=Newark; ComponentLink10Description: http://www.farnell.com/datasheets/1868787.pdf?src-supplier=Newark; ComponentLink11URL: https://www.verical.com/server-webapp/html/getDatasheet?partID=326670&src-supplier=Verical; ComponentLink11Description: https://www.verical.com/server-webapp/html/getDatasheet?partID=326670&src-supplier=Verical; ComponentLink12URL: http://www.yageo.com/documents/recent/PYu-RC0603_51_RoHS_L_7.pdf?src-supplier=Future+Electronics; ComponentLink12Description: http://www.yageo.com/documents/recent/PYu-RC0603_51_RoHS_L_7.pdf?src-supplier=Future+Electronics; ComponentLink13URL: https://datasheet.octopart.com/RC0603FR-071K2L-Yageo-datasheet-62067350.pdf?src-supplier=Element14; ComponentLink13Description: https://datasheet.octopart.com/RC0603FR-071K2L-Yageo-datasheet-62067350.pdf?src-supplier=Element14; ComponentLink14URL: http://www.farnell.com/datasheets/1868787.pdf?src-supplier=Element14; ComponentLink14Description: http://www.farnell.com/datasheets/1868787.pdf?src-supplier=Element14; ComponentLink15URL: http://www.yageo.com/documents/recent/PYu-RC_Group_51_RoHS_L_10.pdf?src-supplier=Digikey; ComponentLink15Description: http://www.yageo.com/documents/recent/PYu-RC_Group_51_RoHS_L_10.pdf?src-supplier=Digikey
R7 = RC0603FR-106K8L: RES 6.8K OHM 1% 1/10W 0603; Manufacturer: Yageo; Designed by: ismet Akalın; Additional Feature: LASER TRIMMABLE; Power: 100mW; Rated Temperature: 70°C; Value: 6.8kR; Working Voltage: 75V; Temperature Coefficient (ppm/Cel): 100; Package Height: 0.45mm; Package Length: 1.6mm; Package Width: 0.8mm; Supplier: Mouser; Supplier Part Number: 603-RC0603FR-106K8L; Manufacturer Part Number: RC0603FR-106K8L; RoHS: Yes; Category: Chip SMD Resistors; Stock: 27642; Pricing: 1=0,1, 10=0,009, 50=0,009, 100=0,007, 1000=0,006, 10000=0,002 (USD); Mounting Technology: Surface Mount; Pins: 2; Package Shape: Rectangular; Case/Package: 0603; Terminal Finish: Nickel; Min Operating Temperature: -55°C; Max Operating Temperature: 155°C; Tolerance: 1%; Termination: Wraparound; JESD-609 Code: e3; Resistor Type: FIXED RESISTOR; Construction: Chip; Packaging: Tape and Reel; Technology: METAL GLAZE/THICK FILM; Reach SVHC Compliant: Yes; RoHS Compliant: Yes; ComponentLink1URL: https://datasheet.ciiva.com:443/pdfs/VipMasterIC/IC/YAGO/YAGO-S-A0008145938/YAGO-S-A0008145938-1.pdf?src-supplier=IHS+Markit; ComponentLink1Description: https://datasheet.ciiva.com:443/pdfs/VipMasterIC/IC/YAGO/YAGO-S-A0008145938/YAGO-S-A0008145938-1.pdf?src-supplier=IHS+Markit; ComponentLink2URL: https://datasheet.ciiva.com/12561/rc0603-272842-12561433.pdf?src-supplier=Mouser; ComponentLink2Description: https://datasheet.ciiva.com/12561/rc0603-272842-12561433.pdf?src-supplier=Mouser
U2 = LM5017MR/NOPB: IC REG BUCK ADJ 600MA 8SOPWR; Manufacturer: TI National Semiconductor; Designed by: ismet Akalın; Package Body Material: Plastic; Throw Configuration: SWITCHING REGULATOR; Control Mode: VOLTAGE-MODE; Max Supply Voltage: 100V; Min Input Voltage: 7.5V; Nominal Supply Voltage: 48V; Channels: 1; Max Output current: 1.3A; Package Equivalence Code: SOP8,.25; Frequency: 1MHz; Qualification Status: Not Qualified; Supplier: Mouser; Supplier Part Number: 926-LM5017MR/NOPB; Manufacturer Part Number: LM5017MR/NOPB; RoHS: Yes; Category: Voltage Regulators - Switching; Stock: 3103; Pricing: 1=3,15, 10=2,39, 50=2,39, 100=1,96, 1000=1,96, 10000=1,96 (USD); Case/Package: HLSOP; Pins: 8; Package Shape: Rectangular; Terminal Finish: Tin; Min Operating Temperature: -40°C; Max Operating Temperature: 125°C; JESD-609 Code: e3; JESD-30 Code: R-PDSO-G8; Moisture Sensitivity Level: 3; Package Style: SMALL OUTLINE, HEAT SINK/SLUG, LOW PROFILEMeter; Peak Reflow Temperature (Cel): 260°C; Surface Mount: Yes; Switcher Configuration: BUCK; Terminal Form: Gull Wing; Terminal Position: DUAL; Length: 4.9mm; Width: 3.9mm; Height - Seated (Max): 1.68mm; Terminal Pitch: 1.27mm; Temperature Grade: AUTOMOTIVE; Reach SVHC Compliant: Yes; RoHS Compliant: Yes; ComponentLink1URL: https://www.ti.com:443/lit/ds/symlink/lm5017.pdf?src-supplier=IHS+Markit; ComponentLink1Description: https://www.ti.com:443/lit/ds/symlink/lm5017.pdf?src-supplier=IHS+Markit; ComponentLink2URL: https://datasheet.ciiva.com/6603/lm5017-6603724.pdf?src-supplier=Digikey; ComponentLink2Description: https://datasheet.ciiva.com/6603/lm5017-6603724.pdf?src-supplier=Digikey